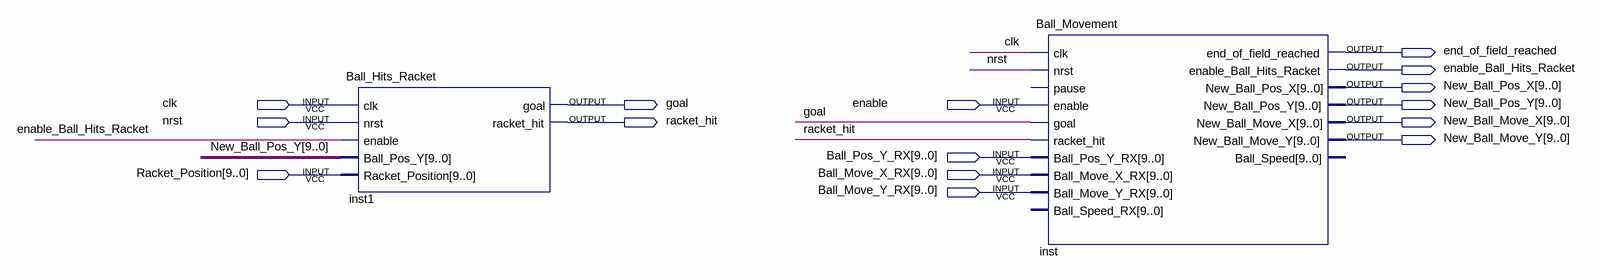
[diagram p0: schematic sheet]
// Quartus schematic Ball_Movement_Test.bdf as structural Verilog: 2 symbols, 15 pins
module Ball_Movement_Test (
  input  clk,
  input  enable,
  input  nrst,
  input  [9:0] Ball_Pos_Y_RX,
  input  [9:0] Racket_Position,
  input  [9:0] Ball_Move_X_RX,
  input  [9:0] Ball_Move_Y_RX,
  output end_of_field_reached,
  output enable_Ball_Hits_Racket,
  output [9:0] New_Ball_Pos_X,
  output goal,
  output [9:0] New_Ball_Pos_Y,
  output racket_hit,
  output [9:0] New_Ball_Move_X,
  output [9:0] New_Ball_Move_Y
);

  Ball_Hits_Racket inst1 (
    .clk(clk), .nrst(nrst), .enable(enable_Ball_Hits_Racket), .Ball_Pos_Y(New_Ball_Pos_Y),
    .Racket_Position(Racket_Position), .goal(goal), .racket_hit(racket_hit));
  Ball_Movement inst (
    .clk(clk), .nrst(nrst), .enable(enable), .goal(goal), .racket_hit(racket_hit),
    .Ball_Pos_Y_RX(Ball_Pos_Y_RX), .Ball_Move_X_RX(Ball_Move_X_RX), .Ball_Move_Y_RX(Ball_Move_Y_RX),
    .end_of_field_reached(end_of_field_reached), .enable_Ball_Hits_Racket(enable_Ball_Hits_Racket),
    .New_Ball_Pos_X(New_Ball_Pos_X), .New_Ball_Pos_Y(New_Ball_Pos_Y), .New_Ball_Move_X(New_Ball_Move_X),
    .New_Ball_Move_Y(New_Ball_Move_Y));  // open: pause, Ball_Speed_RX, Ball_Speed
endmodule
